# EasyEDA schematic schematic.json
TITLE: ESP32-mainDevBoard; REV: 1.0; Date: 2021-11-07; Sheet: 1/1; Company: EduStavebnice
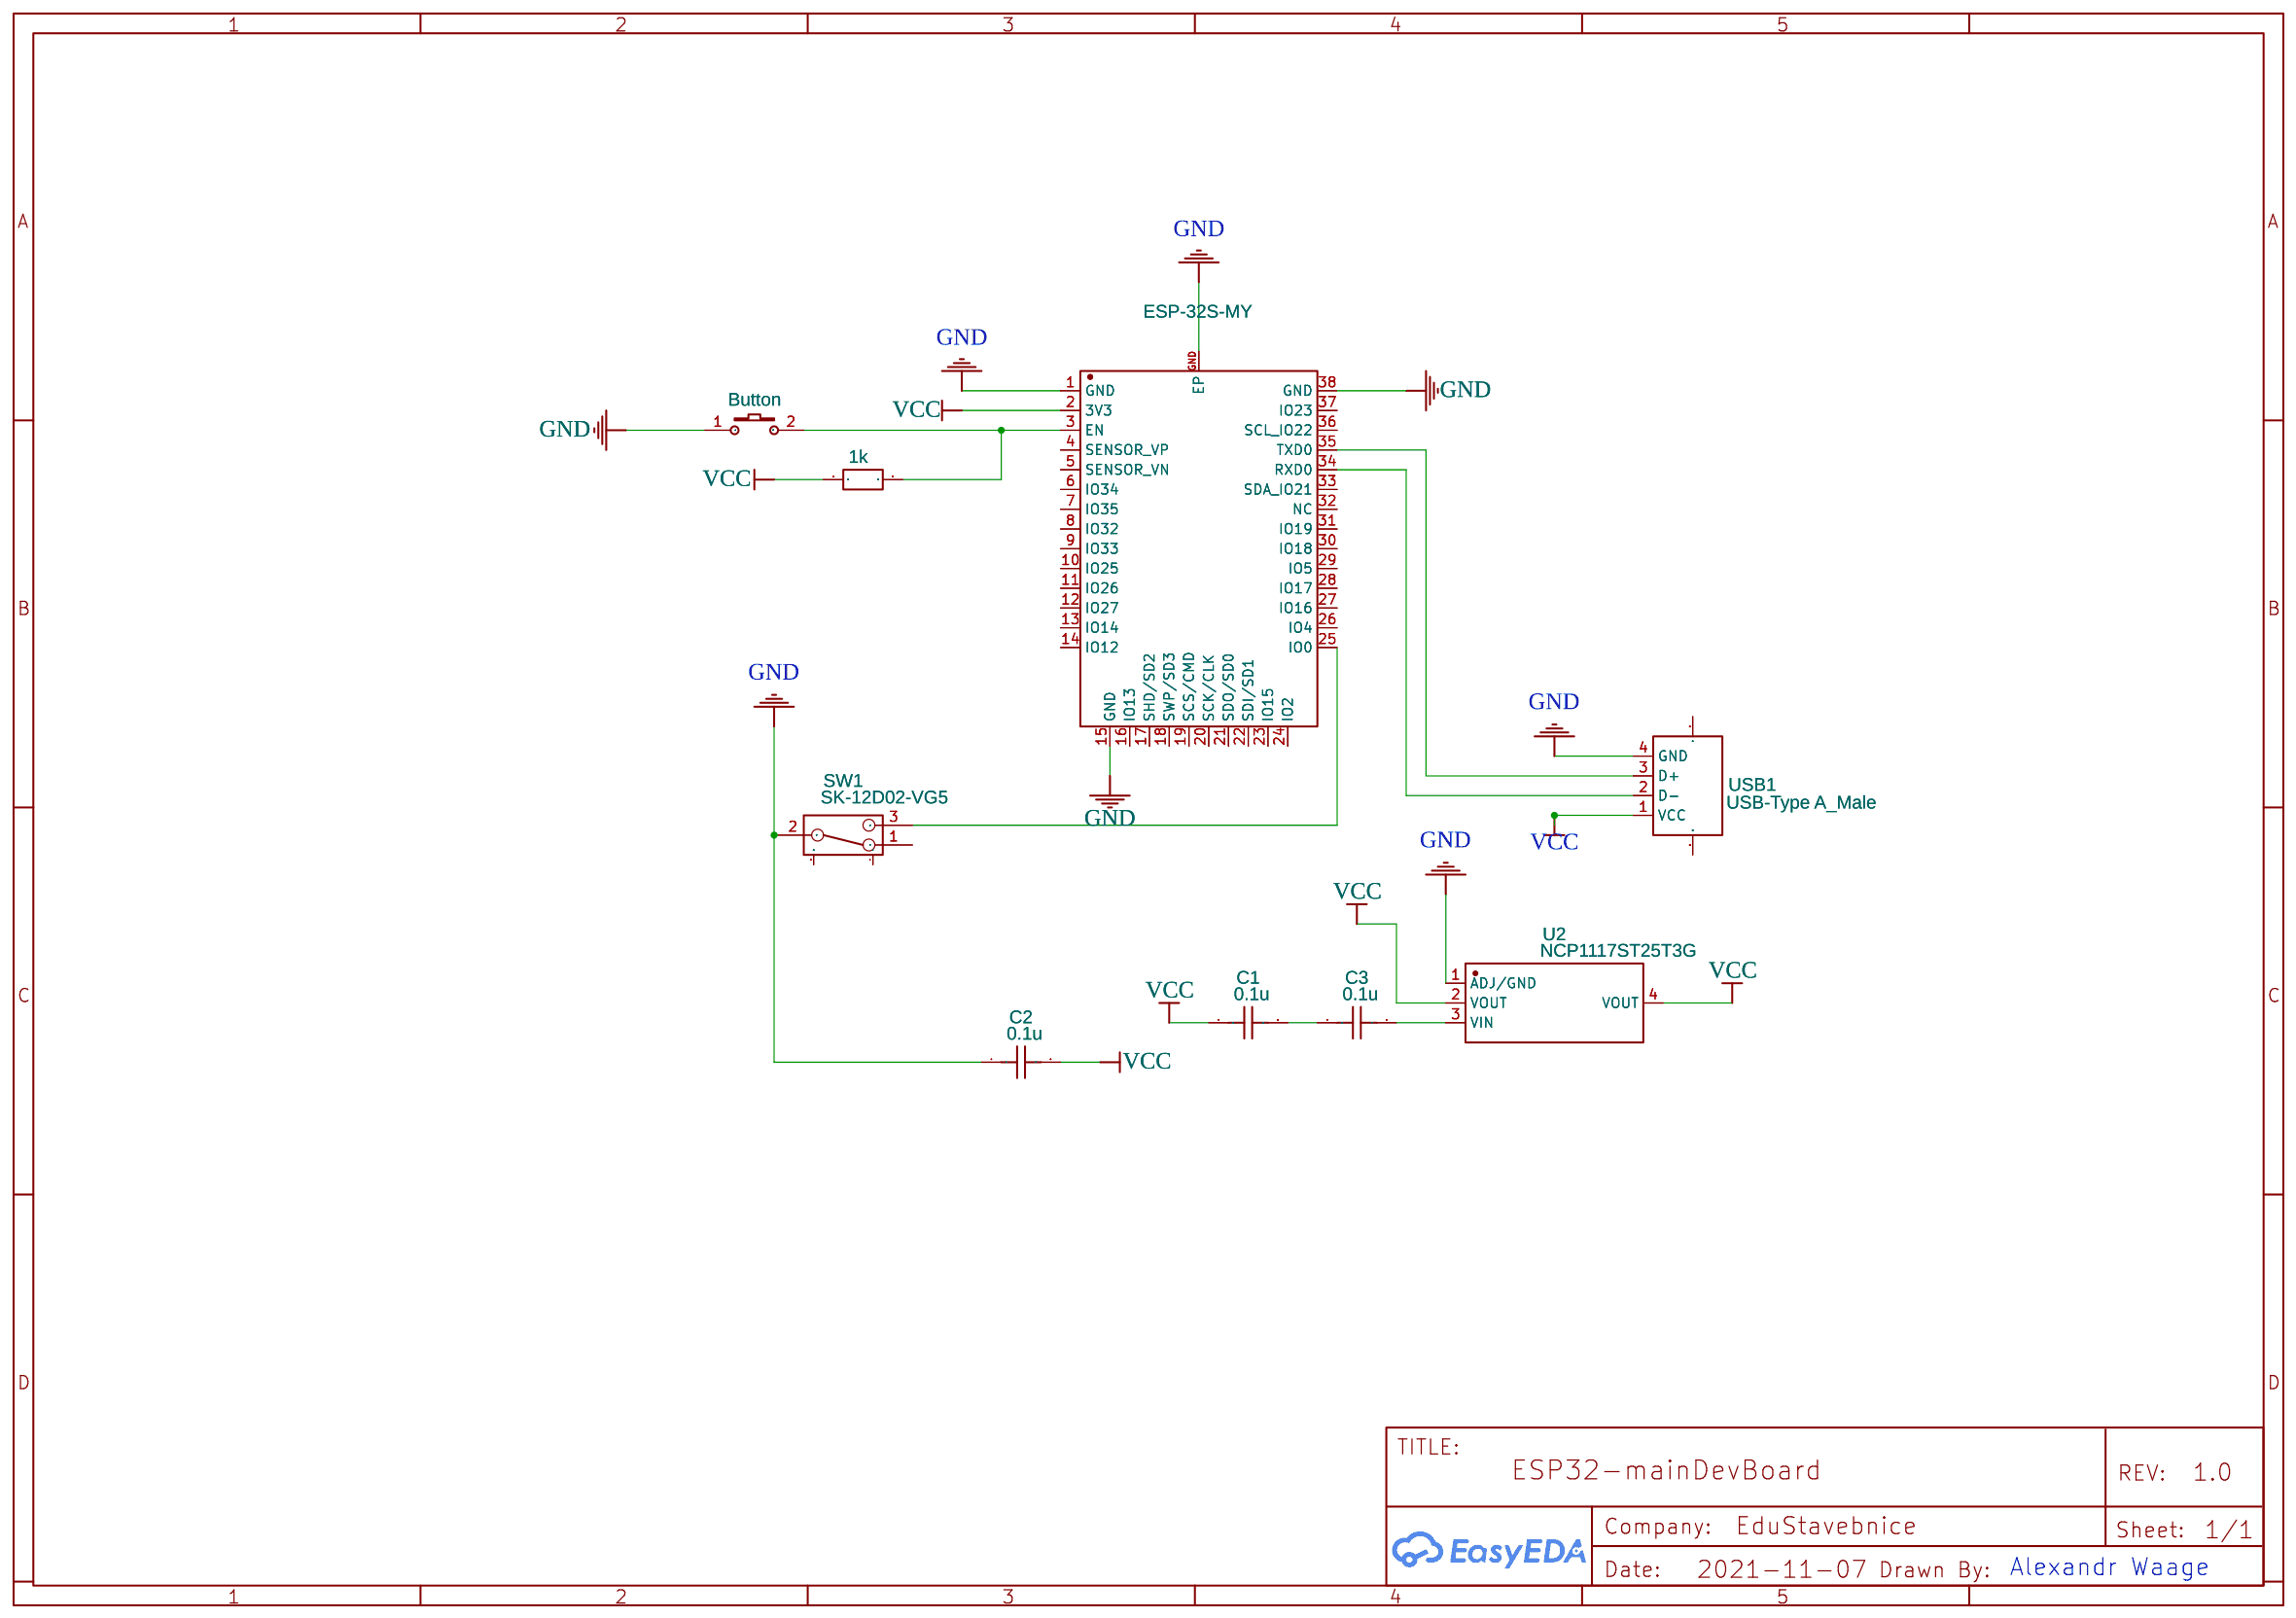
[diagram p0: schematic sheet]

## Parts
C1  0.1u  [C0603]
C2  0.1u  [C0603]
C3  0.1u  [C0603]
KEY1  Button  [KEY-SMD_2P-L6.2-W3.6-LS8.0]
R1  1k  [R0603]
SW1  SK-12D02-VG5  [SW-TH_SK-12D02VG3]
U1  ESP-32S-MY  [ESP32S]
U2  NCP1117ST25T3G  [SOT-223-4_L6.5-W3.5-P2.30-LS7.0-BR]
USB1  USB-Type A_Male  [USB-A-TH_48037-0001]

## Library data of the parts
C1-C3 = C_0603_US: Contributor: LCEDA_Lib
KEY1 = K2-3.6×6.1_SMD: Supplier Part: C118141; Supplier: LCSC; Manufacturer Part: K2-1107ST-A4SW-06; Contributor: LCEDA_Lib; 制造商: 韩国韩荣
R1 = R_0603_EU: Contributor: LCEDA_Lib
SW1 = SK-12D02-VG5: Supplier: LCSC; Supplier Part: C136722; Manufacturer: Rectangular Connectors - Contacts; Contributor: LCSC
U1 = ESP-32S-MY: Contributor: Irakli Tsiklauri
U2 = NCP1117ST25T3G: Supplier: LCSC; Supplier Part: C233237; Manufacturer: ON Semicon; Contributor: LCSC; JLCPCB Part Class: Extended Part
USB1 = USB-Type A_Male: Supplier Part: C112454; Supplier: LCSC; Manufacturer: SOFNG; Manufacturer Part: USB-05; Contributor: LCEDA_Lib

## Nets
GND: C2.1 KEY1.1 SW1.2 U1.1(GND) U1.15(GND) U1.38(GND) U1.GND(EP) U2.1(ADJ/GND) USB1.4(GND)
VCC: C1.1 C2.2 R1.1 U1.2(3V3) U2.2(VOUT) U2.4(VOUT) USB1.1(VCC)
Net-(C1-2): C1.2 C3.1
Net-(C3-2): C3.2 U2.3(VIN)
Net-(KEY1-2): KEY1.2 R1.2 U1.3(EN)
Net-(SW1-3): SW1.3 U1.25(IO0)
Net-(U1-34): U1.34(RXD0) USB1.2(D-)
Net-(U1-35): U1.35(TXD0) USB1.3(D+)

Not connected (* = marked no-connect by the designer): SW1 1 4 5; U1 4(SENSOR_VP) 5(SENSOR_VN) 6(IO34) 7(IO35) 8(IO32) 9(IO33) 10(IO25) 11(IO26) 12(IO27) 13(IO14) 14(IO12) 16(IO13) 17(SHD/SD2) 18(SWP/SD3) 19(SCS/CMD) 20(SCK/CLK) 21(SDO/SD0) 22(SDI/SD1) 23(IO15) 24(IO2) 26(IO4) 27(IO16) 28(IO17) 29(IO5) 30(IO18) 31(IO19) 32(NC) 33(SDA IO21) 36(SCL IO22) 37(IO23); USB1 5 6

## Notes on the sheet
- Alexandr Waage
